# Altium schematic sheet RF_LoRa_&_GPS.SchDoc
size A; SheetNumber: 3; SheetTotal: 7
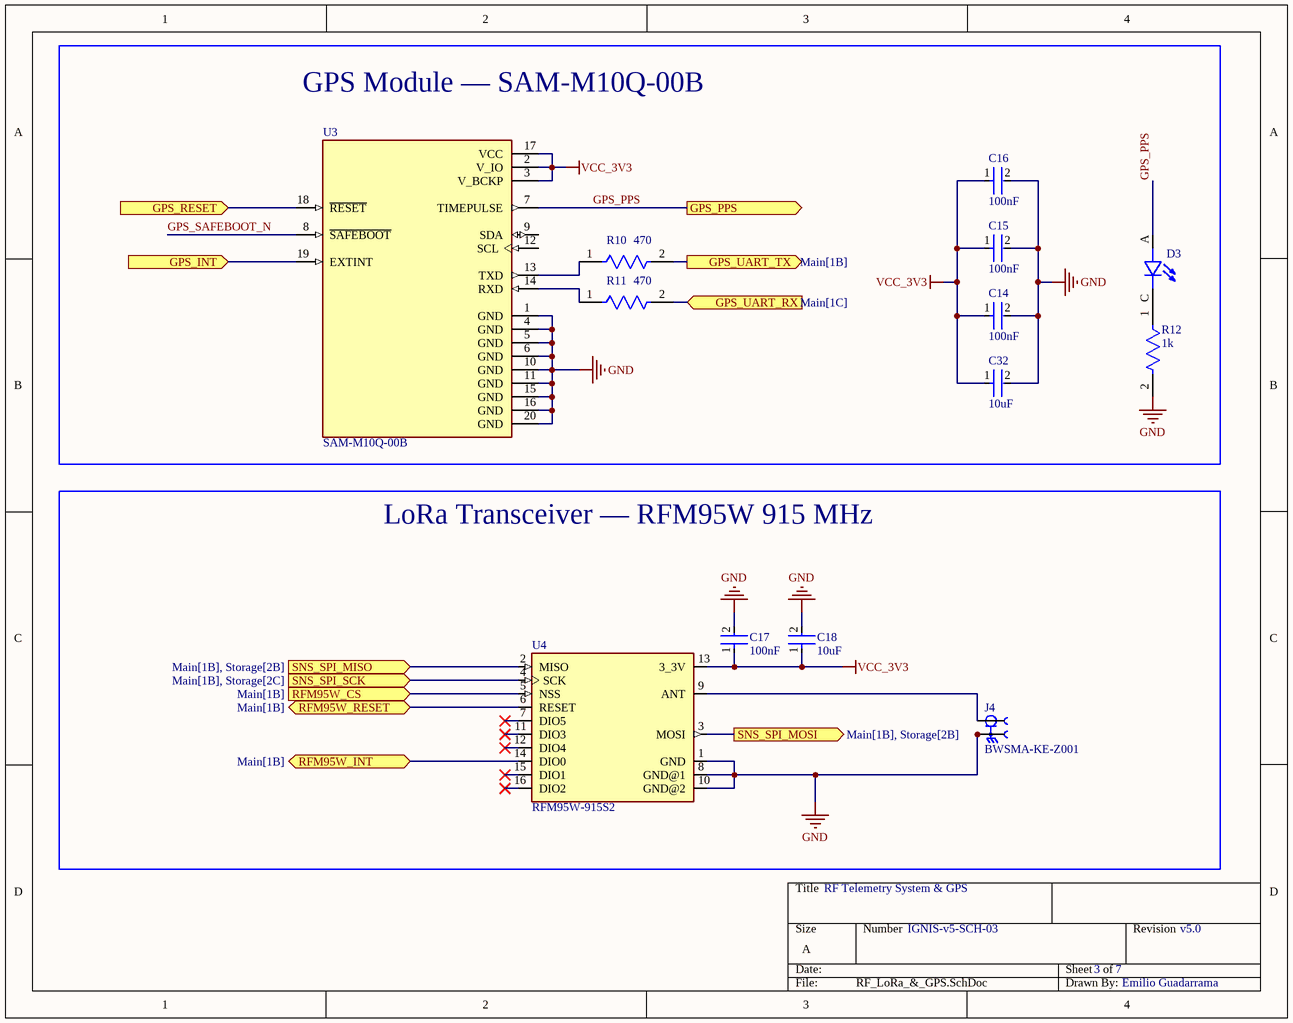
[diagram p0: RF_LoRa_&_GPS.SchDoc]

## Parts
C14  100nF  [FP-C0805C-DN-MFG]
C15  100nF  [FP-C0805C-DN-MFG]
C16  100nF  [FP-C0805C-DN-MFG]
C17  100nF  [FP-C0805C-DN-MFG]
C18  10uF  [FP-C0805C-DN-MFG]
C32  10uF  [FP-C0805C-DN-MFG]
D3  SML-LXT0805IW-TR  [LEDC2012X120N]  (value not drawn)
J4  BWSMA-KE-Z001  [BAT_WIRELESS_BWSMA-KE-Z001]
R10  470  [FP-MCT0603-IPC_A]
R11  470  [FP-MCT0603-IPC_A]
R12  1k  [FP-MCT0603-IPC_A]
U3  SAM-M10Q-00B  [XCVR_SAM-M10Q-00B]
U4  RFM95W-915S2  [XCVR_RFM95W-868S2]

## Blocks framed on the sheet
GPS Module — SAM-M10Q-00B: C14-C16 C32 D3 R10-R12 U3
LoRa Transceiver — RFM95W 915 MHz: C17 C18 J4 U4

## Ports
GPS_INT (in), GPS_PPS (out), GPS_RESET (in), GPS_UART_RX (in, see Main[1C]), GPS_UART_TX (out, see Main[1B]), RFM95W_CS (in, see Main[1B]), RFM95W_INT (bidir, see Main[1B]), RFM95W_RESET (bidir, see Main[1B]), SNS_SPI_MISO (in, see Main[1B], Storage[2B]), SNS_SPI_MOSI (out, see Main[1B], Storage[2B]), SNS_SPI_SCK (in, see Main[1B], Storage[2C])

## Nets
GND: C14.2 C15.2 C16.2 C17.2 C18.2 C32.2 J4.2_1 J4.2_2 J4.2_3 J4.2_4 R12.2 U3.1(GND) U3.4(GND) U3.5(GND) U3.6(GND) U3.10(GND) U3.11(GND) U3.15(GND) U3.16(GND) U3.20(GND) U4.1(GND) U4.8(GND@1) U4.10(GND@2)
VCC_3V3: C14.1 C15.1 C16.1 C17.1 C18.1 C32.1 U3.2(V_IO) U3.3(V_BCKP) U3.17(VCC) U4.13(3_3V)
GPS_INT: U3.19(EXTINT) ; port GPS_INT
GPS_PPS: D3.A U3.7(TIMEPULSE) ; port GPS_PPS
GPS_RESET: U3.18(~{RESET}) ; port GPS_RESET
GPS_SAFEBOOT_N: U3.8(~{SAFEBOOT})
GPS_UART_RX: R11.2 ; port GPS_UART_RX
GPS_UART_TX: R10.2 ; port GPS_UART_TX
RFM95W_CS: U4.5(NSS) ; port RFM95W_CS
RFM95W_INT: U4.14(DIO0) ; port RFM95W_INT
RFM95W_RESET: U4.6(RESET) ; port RFM95W_RESET
SNS_SPI_MISO: U4.2(MISO) ; port SNS_SPI_MISO
SNS_SPI_MOSI: U4.3(MOSI) ; port SNS_SPI_MOSI
SNS_SPI_SCK: U4.4(SCK) ; port SNS_SPI_SCK
NetD3_C: D3.C R12.1
NetJ4_1: J4.1 U4.9(ANT)
NetR10_1: R10.1 U3.13(TXD)
NetR11_1: R11.1 U3.14(RXD)

Not connected (* = marked no-connect by the designer): U3 9(SDA) 12(SCL); U4 7(DIO5)* 11(DIO3)* 12(DIO4)* 15(DIO1)* 16(DIO2)*

## Notes on the sheet
- RF Telemetry System & GPS
- IGNIS-v5-SCH-03
- 3
- 7
- v5.0
- Emilio Guadarrama

## Library data of the parts
C14-C18 = CMP-2007-00279-2: CAP CER 0.1UF 50V X7R 0805; Manufacturer Part Number: C0805C104K5RACTU; Manufacturer: KEMET; Tolerance: 0.1; Temperature Coefficient: 30ppm/°C; Material: Ceramic; Device Class L2: Capacitors; Temperature Range Low: -55°C; Voltage Rating: 50 V; Digikey Description: CAP CER 0.1UF 50V X7R 0805; Category: Cap; ComponentLink2Description: Datasheet; Octopart: https://octopart.com/c0805c104k5ractu-kemet-143926; RoHS: TRUE; ComponentLink2URL: https://content.kemet.com/datasheets/KEM_C1003_C0G_SMD.pdf; Temperature Characteristic: X7R; Temperature: -55°C to +125°C; Height: 0.88mm; Temperature Range High: +125°C; Device Class L1: Passive Components; Automotive: No; Lead Free: Yes; Ipc Land Pattern Name: CAPC200125X78; Device Class L3: Ceramic Capacitors; Mouser Description: Cap Ceramic 0.1uF 50V X7R 10% SMD 2.0 x 1.2 mm 125 C Paper T/R; Package: C0805C-DN
  C14-C17: Value: 100 nF; Capacitance: 100 nF
  C18: Value: 10 uF; Capacitance: 10 uF
C32 = CMP-2007-00279-2: CAP CER 0.1UF 50V X7R 0805; Manufacturer Part Number: C0805C104K5RACTU; Manufacturer: KEMET; Value: 100 nF; Tolerance: 0.1; Temperature Coefficient: 30ppm/°C; Material: Ceramic; Device Class L2: Capacitors; Temperature Range Low: -55°C; Voltage Rating: 50 V; Digikey Description: CAP CER 0.1UF 50V X7R 0805; Category: Cap; ComponentLink2Description: Datasheet; Octopart: https://octopart.com/c0805c104k5ractu-kemet-143926; RoHS: TRUE; ComponentLink2URL: https://content.kemet.com/datasheets/KEM_C1003_C0G_SMD.pdf; Temperature Characteristic: X7R; Temperature: -55°C to +125°C; Height: 0.88mm; Temperature Range High: +125°C; Device Class L1: Passive Components; Automotive: No; Lead Free: Yes; Ipc Land Pattern Name: CAPC200125X78; Device Class L3: Ceramic Capacitors; Mouser Description: Cap Ceramic 0.1uF 50V X7R 10% SMD 2.0 x 1.2 mm 125 C Paper T/R; Capacitance: 100 nF; Package: C0805C-DN
D3 = SML-LXT0805IW-TR: LED;Red;11mcd;0.061In.Dia.;SMD;100mA;2V Vf;635nm;140deg;SMD;White Diffused;5V Vr | Lumex SML-LXT0805IW-TR; MF: Lumex Opto/Components; SnapEDA_Link: https://www.snapeda.com/parts/SML-LXT0805IW-TR/Lumex+Opto%252FComponents+Inc./view-part/?ref=snap; Package: 0805 Lumex; Value: *; MP: SML-LXT0805IW-TR; Check_prices: https://www.snapeda.com/parts/SML-LXT0805IW-TR/Lumex+Opto%252FComponents+Inc./view-part/?ref=eda
J4 = BWSMA-KE-Z001: 1 Inner bore SMA Board Edge Positive foot -65â„ƒ~+165â„ƒ 50Î© Plugin RF Connectors / Coaxial Connectors ROHS; MF: Bat Wireless; SnapEDA_Link: https://www.snapeda.com/parts/BWSMA-KE-Z001/Bat+Wireless/view-part/?ref=snap; Package: None; Value: *; MP: BWSMA-KE-Z001; Check_prices: https://www.snapeda.com/parts/BWSMA-KE-Z001/Bat+Wireless/view-part/?ref=eda
R10 R11 = CMP-02407-011165-1: RES SMD 100 OHM 1% 1/8W 0603; Temperature Coefficient: 25ppm/°C; Resistance: 470R; Power Rating: 125mW; Tolerance: 0.1%; Voltage Rating: 75V; Length: 1.55mm; Case Code (Imperial): 0603; Case/Package: 0603; Construction: Rectangular; Package Quantity: 1000; Number of Terminations: 2; Termination: SMD/SMT; Resistor Type: Thin Film; Features: Automotive AEC-Q200; Series: MCT 0603 - Precision; Max Operating Temperature: 155°C; Depth: 0.85mm; Max Power Dissipation: 125mW; Min Operating Temperature: -55°C; Width: 0.033inch; Case Code (Metric): 1608; Packaging: Tape and Reel; Weight: 6.7E-05oz; Military Standard: Not; Height: 0.022inch
R12 = CMP-02407-011165-1: RES SMD 100 OHM 1% 1/8W 0603; Temperature Coefficient: 25ppm/°C; Resistance: 1kR; Power Rating: 125mW; Tolerance: 0.1%; Voltage Rating: 75V; Length: 1.55mm; Case Code (Imperial): 0603; Case/Package: 0603; Construction: Rectangular; Package Quantity: 1000; Number of Terminations: 2; Termination: SMD/SMT; Resistor Type: Thin Film; Features: Automotive AEC-Q200; Series: MCT 0603 - Precision; Max Operating Temperature: 155°C; Depth: 0.85mm; Max Power Dissipation: 125mW; Min Operating Temperature: -55°C; Width: 0.033inch; Case Code (Metric): 1608; Packaging: Tape and Reel; Weight: 6.7E-05oz; Military Standard: Not; Height: 0.022inch
U3 = SAM-M10Q-00B: - RF Receiver Galileo, GLONASS, GPS 1.575GHz, 1.602GHz -165dBm 400kbps On-Board, Patch Module; MF: u-blox; SnapEDA_Link: https://www.snapeda.com/parts/SAM-M10Q-00B/u-blox/view-part/?ref=snap; Package: None; Value: *; MP: SAM-M10Q-00B; Check_prices: https://www.snapeda.com/parts/SAM-M10Q-00B/u-blox/view-part/?ref=eda
U4 = RFM95W-868S2: General ISM < 1GHz LoRa, Transceiver Module 915MHz Antenna Not Included Surface Mount; MF: RF; Package: Non Standard RF Solutions; Price: None; Check_prices: https://www.snapeda.com/parts/RFM95W-868S2/RF+Solutions/view-part/?ref=eda; Value: *; SnapEDA_Link: https://www.snapeda.com/parts/RFM95W-868S2/RF+Solutions/view-part/?ref=snap; MP: RFM95W-868S2; Availability: In Stock; Purchase-URL: https://pricing.snapeda.com/search?q=RFM95W-868S2&ref=eda